# Altium schematic sheet TMouse.schDoc
size A3; Organization: Altium Limited; Address1: L3, 12a Rodborough Rd; Address2: Frenchs Forest; Address3: NSW; Address4: Australia 2086; DocumentNumber: 8; SheetNumber: 8; SheetTotal: 22
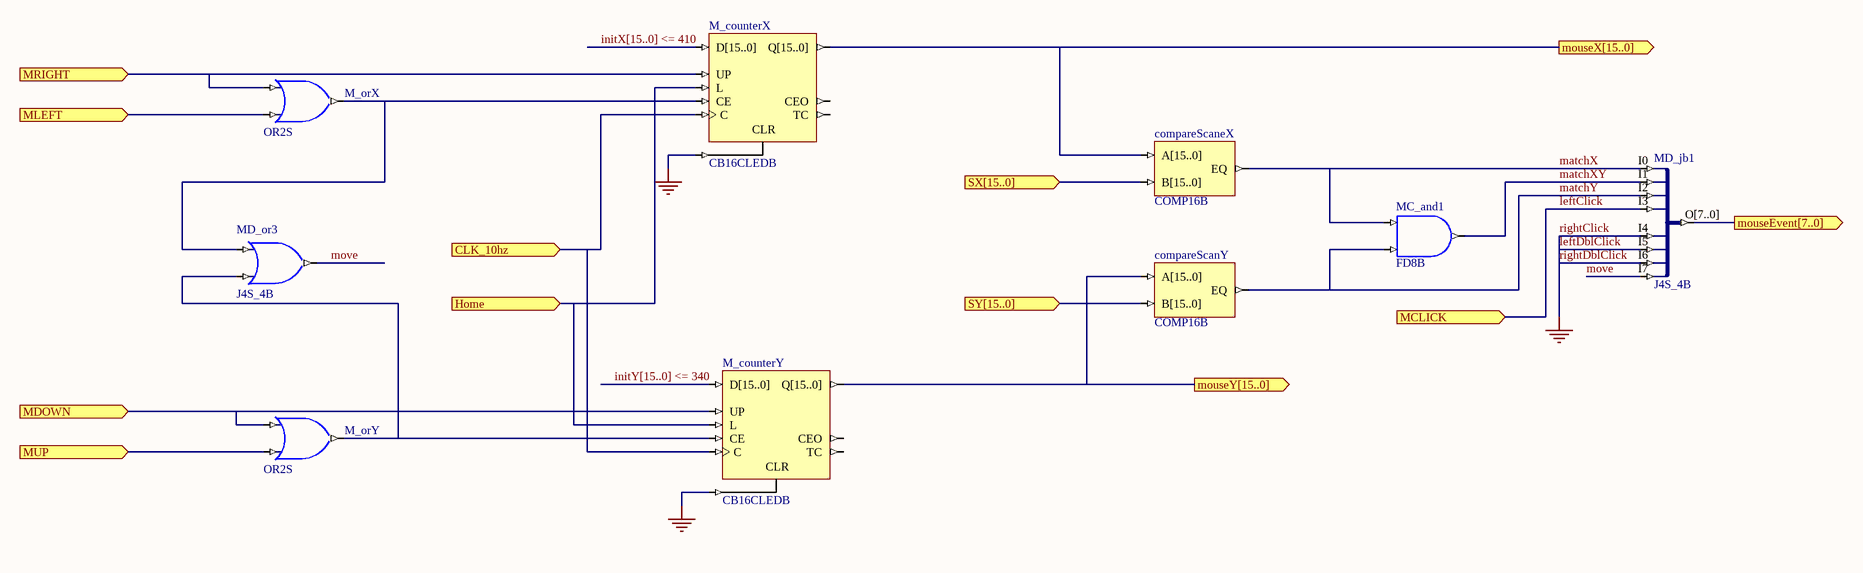
[diagram p0: TMouse.schDoc]

## Parts
compareScaneX  COMP16B
compareScanY  COMP16B
M_counterX  CB16CLEDB
M_counterY  CB16CLEDB
M_orX  OR2S
M_orY  OR2S
MC_and1  FD8B
MD_jb1  J4S_4B
MD_or3  J4S_4B

## Ports
CLK_10hz (in), Home (in), MCLICK (in), MDOWN (in), MLEFT (in), mouseEvent[7..0] (out), mouseX[15..0] (out), mouseY[15..0] (out), MRIGHT (in), MUP (in), SX[15..0] (in), SY[15..0] (in)

## Nets
leftDblClick: M_counterX.CLR M_counterY.CLR MD_jb1.I4 MD_jb1.I5 MD_jb1.I6  [also labelled GND, rightClick, rightDblClick]
CLK_10hz: M_counterX.C M_counterY.C ; port CLK_10hz
Home: M_counterX.L M_counterY.L ; port Home
initX[15..0] <= 410: M_counterX.D[15..0]
initY[15..0] <= 340: M_counterY.D[15..0]
leftClick: MD_jb1.I3 ; port MCLICK
matchX: compareScaneX.EQ MC_and1.I0 MD_jb1.I0
matchXY: MC_and1.O MD_jb1.I1
matchY: compareScanY.EQ MC_and1.I1 MD_jb1.I2
MDOWN: M_counterY.UP M_orY.I0 ; port MDOWN
MLEFT: M_orX.I1 ; port MLEFT
mouseEvent[7..0]: MD_jb1.O[7..0] ; port mouseEvent[7..0]
mouseX[15..0]: compareScaneX.A[15..0] M_counterX.Q[15..0] ; port mouseX[15..0]
mouseY[15..0]: compareScanY.A[15..0] M_counterY.Q[15..0] ; port mouseY[15..0]
move: MD_jb1.I7 MD_or3.O
MRIGHT: M_counterX.UP M_orX.I0 ; port MRIGHT
MUP: M_orY.I1 ; port MUP
SX[15..0]: compareScaneX.B[15..0] ; port SX[15..0]
SY[15..0]: compareScanY.B[15..0] ; port SY[15..0]
NetM_counterX_CE: M_counterX.CE M_orX.O MD_or3.I0
NetM_counterY_CE: M_counterY.CE M_orY.O MD_or3.I1

Not connected (* = marked no-connect by the designer): M_counterX CEO TC; M_counterY CEO TC

## Buses and harness runs
bus initX[15..0] <= 410
bus initY[15..0] <= 340

## Notes on the sheet
- Title
- Size:
- Date:
- A3
- Number:
- Time:
- Revision:
- Sheet
- of
- File:

## Library data of the parts
compareScaneX compareScanY = COMP16B: 16-Bit Identity Comparator, Bus Version; Xilinx Equivalent: COMP16; ArchiveName: GENERIC; Published: 9-30-2003; Publisher: Altium Limited; Core Revision: 1.00.00
M_counterX M_counterY = CB16CLEDB: 16-Bit Loadable Cascadable Bidirectional Binary Counter with Clock Enable and Asynchronous Clear, Bus Version; ArchiveName: GENERIC; Published: 9-30-2003; Publisher: Altium Limited; Xilinx Equivalent: CB16CLED; Core Revision: 1.00.00
M_orX M_orY MD_or3 = OR2S: 2-Input OR Gate, Single Pin Version; Xilinx Equivalent: OR2; ArchiveName: GENERIC; Published: 9-30-2003; Publisher: Altium Limited; Core Revision: 1.00.00
MC_and1 = AND2S: 2-Input AND Gate, Single Pin Version; Xilinx Equivalent: AND2; ArchiveName: GENERIC; Published: 9-30-2003; Publisher: Altium Limited; Core Revision: 1.00.00
MD_jb1 = J8S_8B: 8 Single pin inputs to single 8-Bit output bus; ArchiveName: GENERIC; Published: 9-30-2003; Publisher: Altium Limited; Core Revision: 1.00.00